# EAGLE design Lora_sensor (EAGLE 9.5.2)
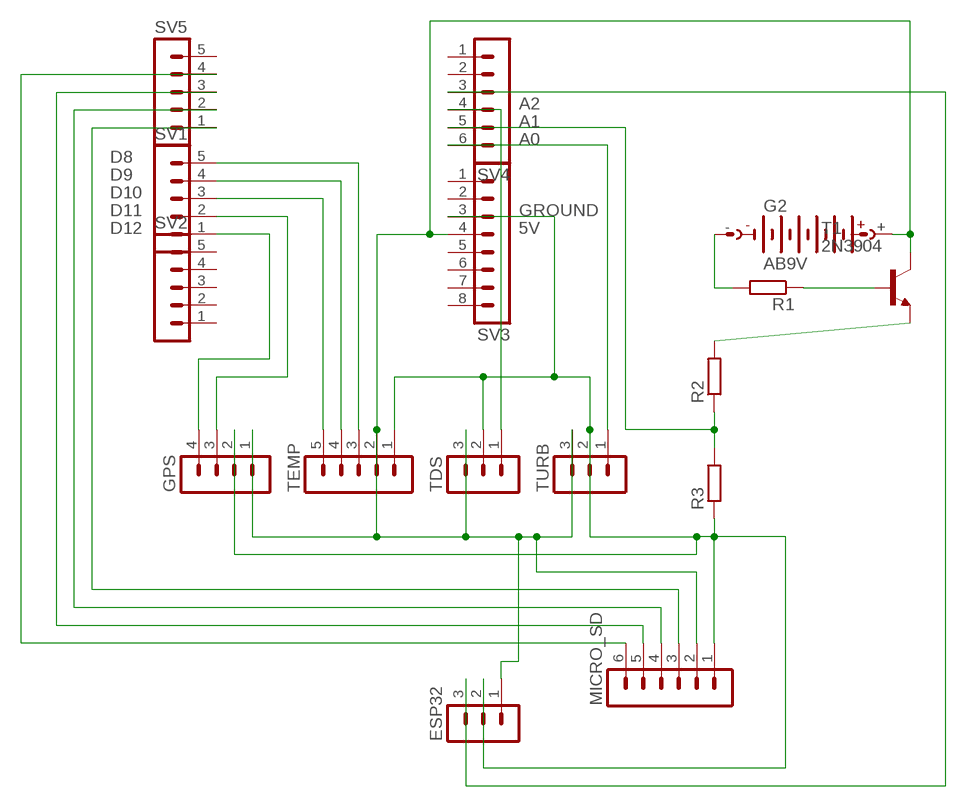
[diagram p0: schematic, sheet 1]

## Parts
ESP32  MA03-1  [MA03-1]
G2  AB9V  [AB9V]
GPS  MA04-1  [MA04-1]
MICRO_SD  MA06-1  [MA06-1]
R1  R-EU_0204/7  [0204/7]
R2  R-EU_0204/7  [0204/7]
R3  R-EU_0204/7  [0204/7]
SV1  MA05-1  [MA05-1]
SV2  MA05-1  [MA05-1]
SV3  MA08-1  [MA08-1]
SV4  MA06-1  [MA06-1]
SV5  MA05-1  [MA05-1]
T1  2N3904  [TO92]
TDS  MA03-1  [MA03-1]
TEMP  MA05-1  [MA05-1]
TURB  MA03-1  [MA03-1]

## Nets
5V: ESP32.1 G2.+ GPS.1 MICRO_SD.2 SV3.4 T1.1(C) TDS.3 TEMP.2 TURB.3
A0: SV4.6 TURB.1
A1: R2.1 R3.2 SV4.5
A2: SV4.4 TDS.1
D8: SV1.5 TEMP.3
D9: SV1.4 TEMP.4
D10: SV1.3 TEMP.5
D11: GPS.3 SV1.2
D12: GPS.4 SV1.1
GROUND: ESP32.2 GPS.2 MICRO_SD.1 R3.1 SV3.3 TDS.2 TEMP.1 TURB.2
N$2: MICRO_SD.3 SV5.1
N$3: MICRO_SD.4 SV5.2
N$4: MICRO_SD.5 SV5.3
N$5: MICRO_SD.6 SV5.4
N$7: ESP32.3 SV4.3
N$9: R2.2 T1.3(E)
N$13: G2.- R1.2
N$14: R1.1 T1.2(B)
Unconnected: SV2.1 SV2.2 SV2.3 SV2.4 SV2.5 SV3.1 SV3.2 SV3.5 SV3.6 SV3.7 SV3.8 SV4.1 SV4.2 SV5.5

## Library data of the parts
ESP32 TDS TURB = con-lstb:MA03-1: PIN HEADER; OC_FARNELL: unknown; OC_NEWARK: unknown
G2 = battery:AB9V: 9-V BATTERY CLIP
GPS = con-lstb:MA04-1: PIN HEADER; OC_FARNELL: unknown; OC_NEWARK: unknown
MICRO_SD SV4 = con-lstb:MA06-1: PIN HEADER; OC_FARNELL: unknown; OC_NEWARK: unknown
R1-R3 = rcl:R-EU_: RESISTOR, European symbol; SPICEPREFIX: R
SV1 SV2 SV5 TEMP = con-lstb:MA05-1: PIN HEADER; OC_FARNELL: unknown; OC_NEWARK: unknown
SV3 = con-lstb:MA08-1: PIN HEADER; OC_FARNELL: unknown; OC_NEWARK: unknown
T1 = transistor:2N3904: NPN TRANSISTOR

## Board
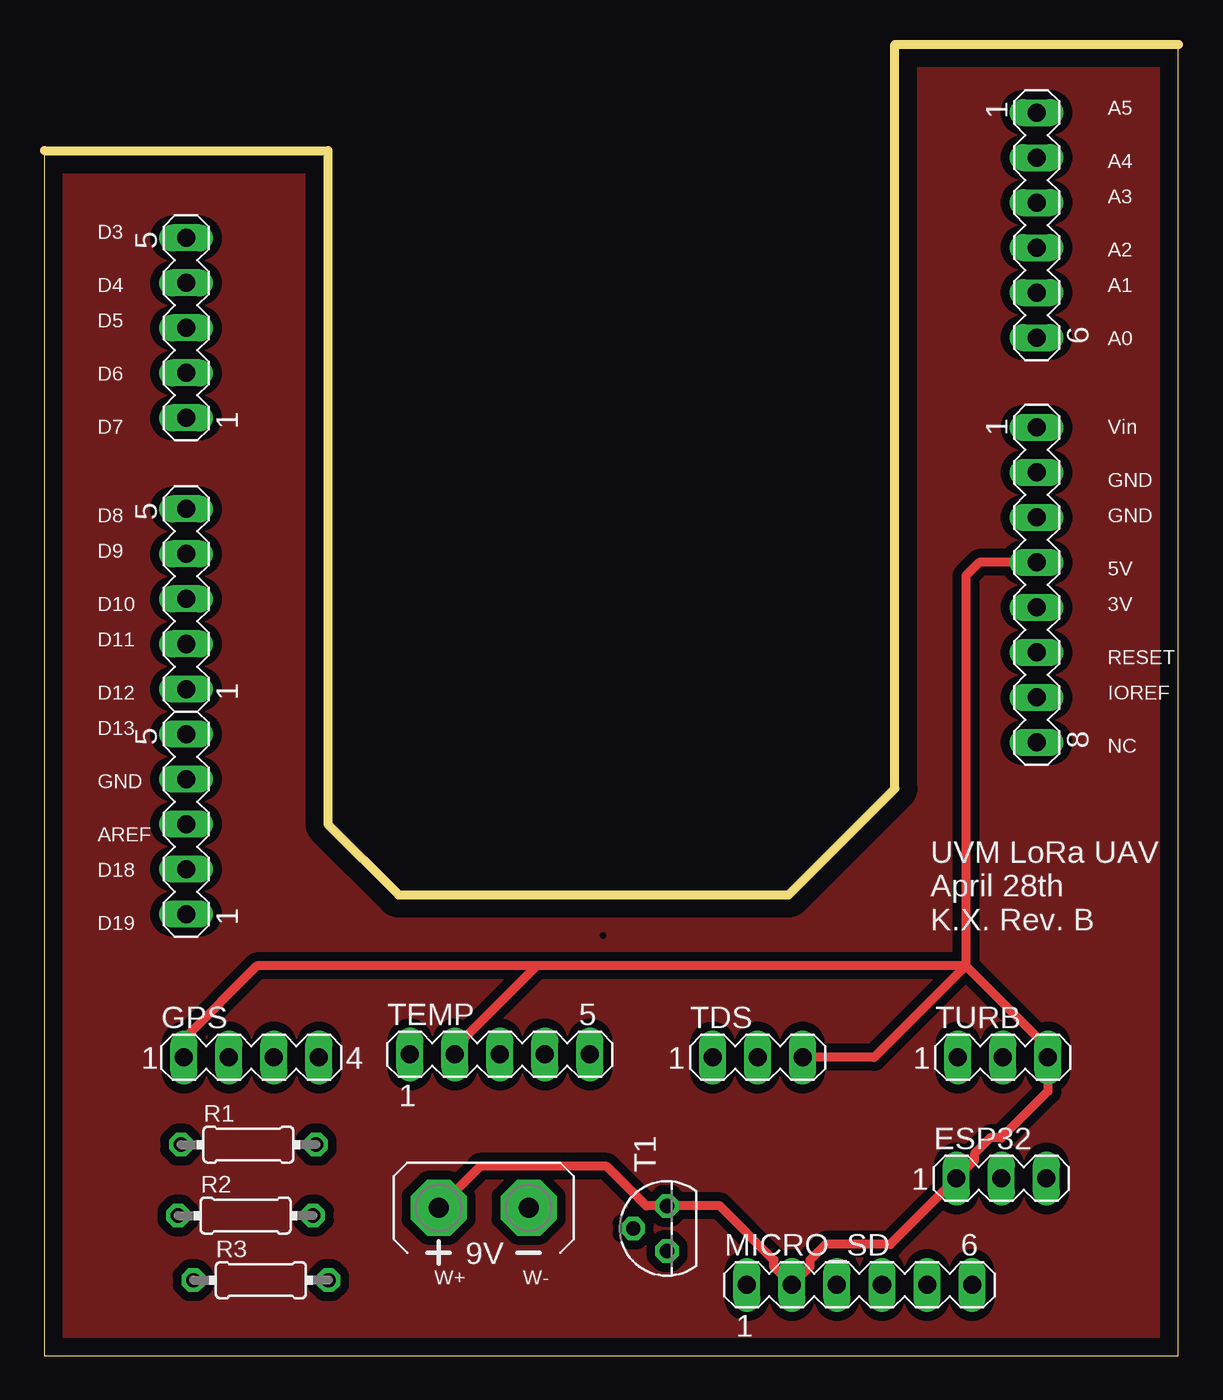
[diagram p1: board, top side]
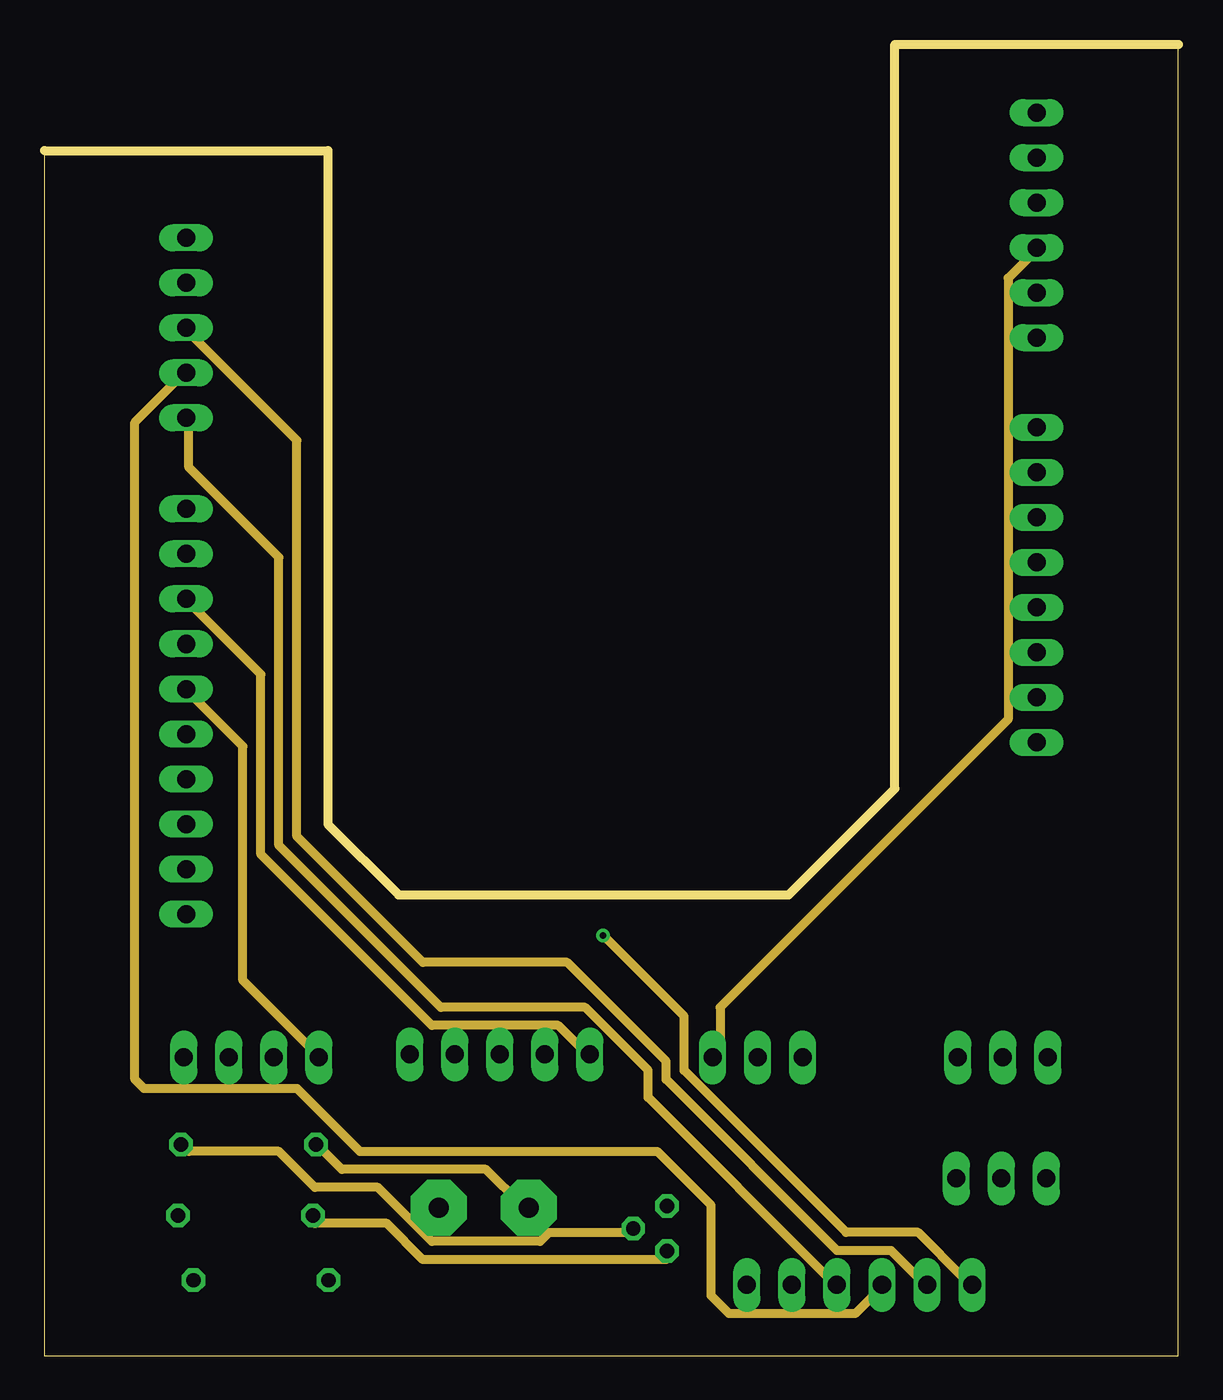
[diagram p2: board, inner layer Route2]
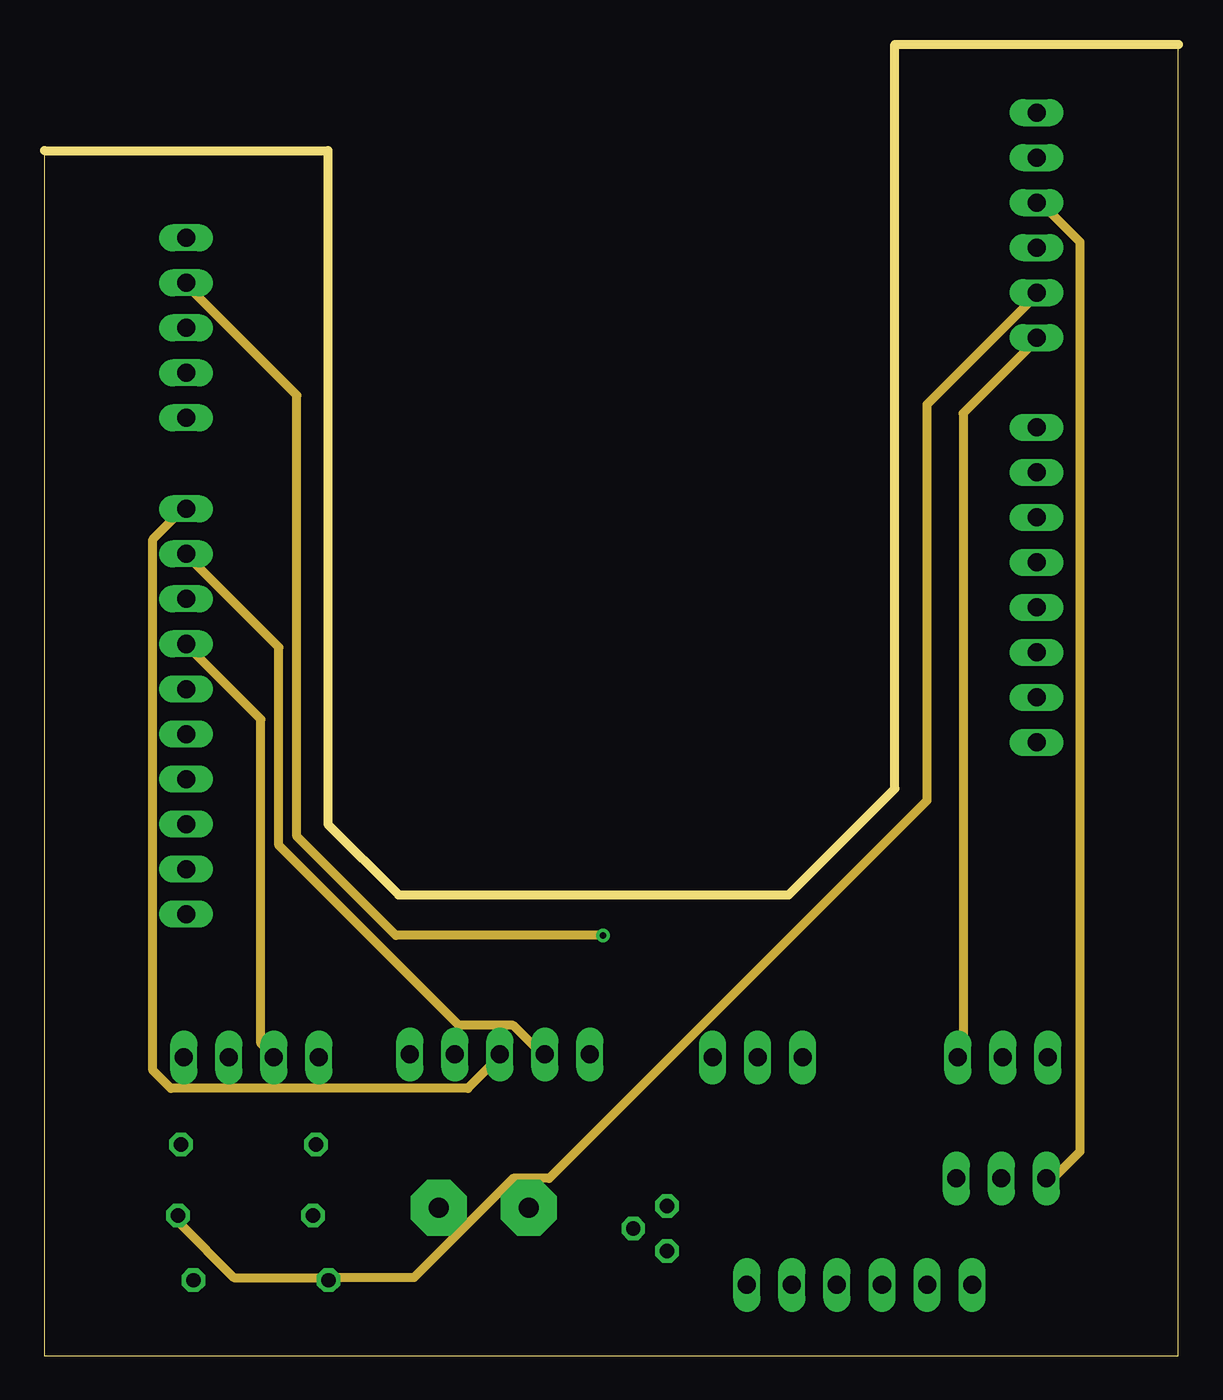
[diagram p3: board, inner layer Route15]
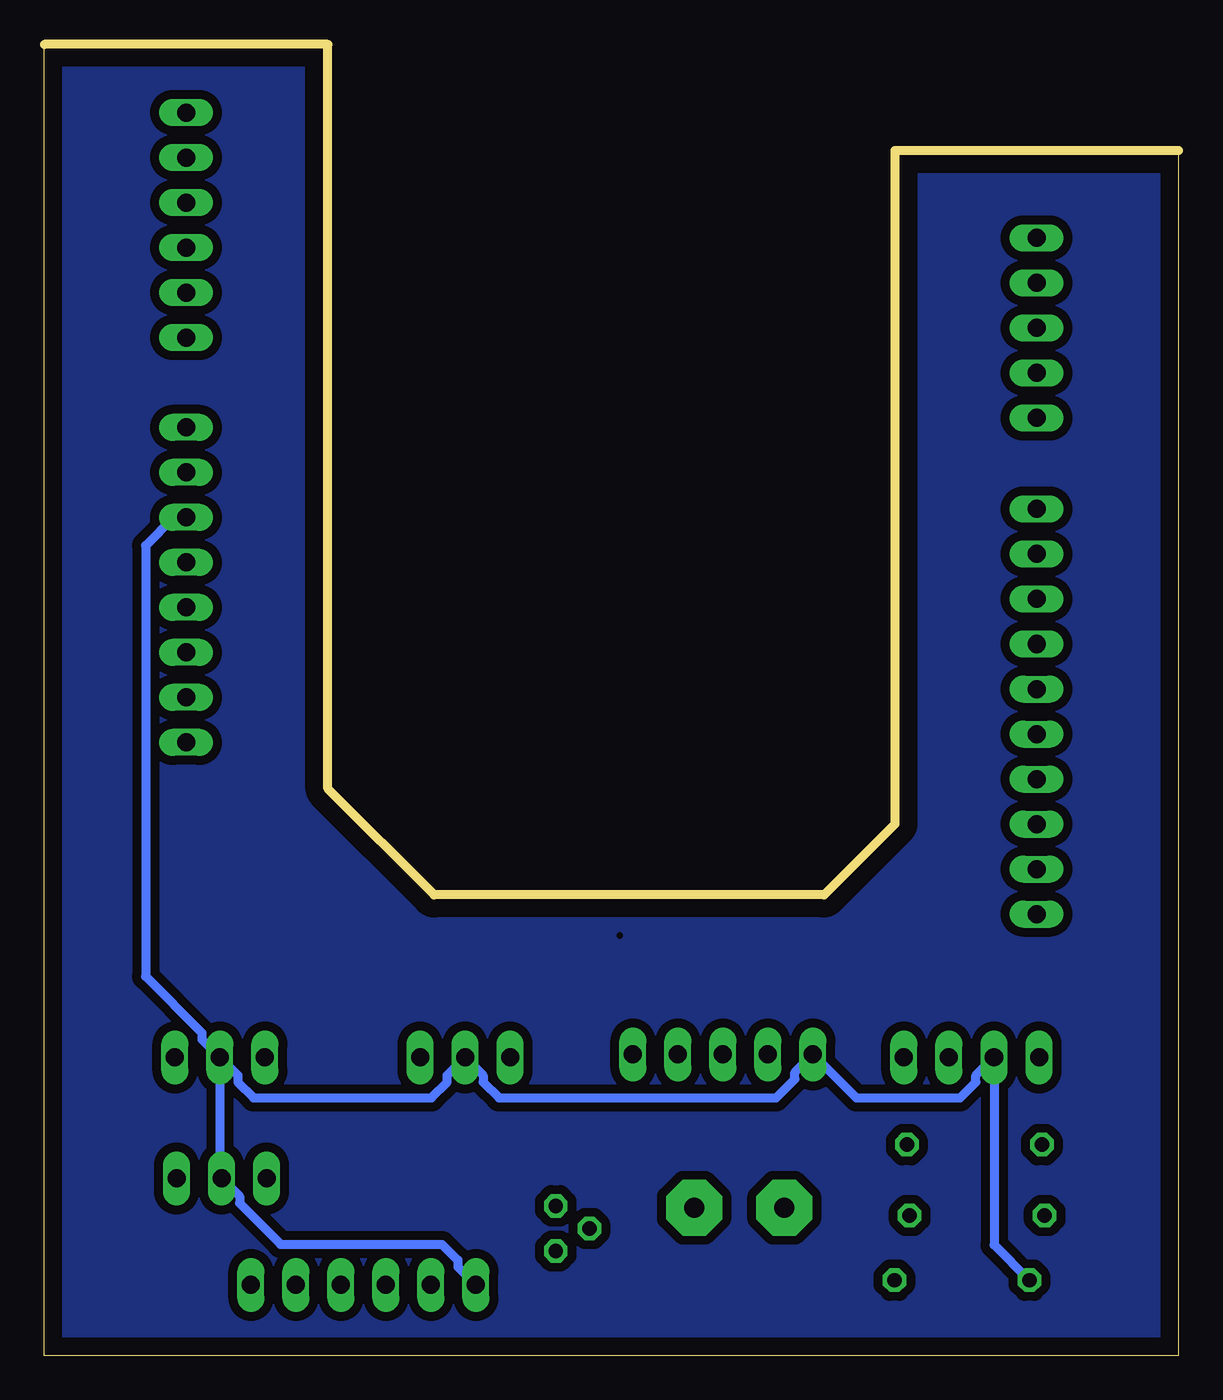
[diagram p4: board, bottom side, seen from below]

Size 64 x 74 mm. Coordinates in mm from the lower left corner, seen from the top.
Outline: 0,0 64,0 64,74 48,74 48,32 42,26 20,26 16,30 16,68 0,68 0,0
Copper layers (1+(2*15)+16): Top 0.035mm / dielectric 1.5mm / Route2 0.035mm / dielectric 0.15mm / Route15 0.035mm / dielectric 0.2mm / Bottom 0.035mm
Design rules "default *": minimum track width 20mil, minimum drill 0.35mm, track to track 20mil, track to pad 20mil, pad to pad 20mil, via to via 20mil, smd to smd 6mil, copper to edge 40mil, drill to drill 6mil, minimum pad ring 10mil, minimum via ring 8mil, stop-mask expansion 4mil, vias tented up to drill 0mil, thermal gap 10mil

### Footprints (pad centres in the part's own frame; a part is rotated, then mirrored left to right if it is on the bottom)
MA03-1 = drill 1.016 long: 1 -2.54,0; 2 0,0; 3 2.54,0
AB9V = drill 1.118 pad 3.15 octagon: + 0,2.54; - 0,-2.54
MA04-1 = drill 1.016 long: 1 -3.81,0; 2 -1.27,0; 3 1.27,0; 4 3.81,0
MA06-1 = drill 1.016 long: 1 -6.35,0; 2 -3.81,0; 3 -1.27,0; 4 1.27,0; 5 3.81,0; 6 6.35,0
0204/7 = drill 0.813 octagon: 1 -3.81,0; 2 3.81,0
MA05-1 = drill 1.016 long: 1 -5.08,0; 2 -2.54,0; 3 0,0; 4 2.54,0; 5 5.08,0
MA08-1 = drill 1.016 long: 1 -8.89,0; 2 -6.35,0; 3 -3.81,0; 4 -1.27,0; 5 1.27,0; 6 3.81,0; 7 6.35,0; 8 8.89,0
TO92 = drill 0.813 octagon: 1 1.27,0; 2 0,1.905; 3 -1.27,0

### Placement (x,y rotation side)
ESP32  54,10 0 top
G2  24.79,8.35 90 top
GPS  11.68,16.83 0 top
MICRO_SD  46,4 0 top
R1  11.52,11.91 0 top
R2  11.36,7.91 0 top
R3  12.22,4.26 0 top
SV1  8,42.7 90 top
SV2  8,30 90 top
SV3  56,43.5 270 top
SV4  56,63.8 270 top
SV5  8,58 90 top
T1  35.14,7.18 90 top
TDS  40.25,16.83 0 top
TEMP  25.71,17 0 top
TURB  54.09,16.83 0 top

### Tracks (layer width: path | path; a pad name or v marks a point on that pad's centre or on a via)
5V
  Top 0.508: SV3.4 52.77,44.77 52,44 52,22 | 52,22 56.63,17.37 TURB.3 56.63,14.92 54,12.29 53.37,12.29 52.48,11.39 52.48,11.02 ESP32.1 47.75,6.29 44.1,6.29 43.21,5.39 43.21,5.02 MICRO_SD.2 41.17,5.02 41.17,5.39 38.12,8.45 T1.1 33.98,8.45 31.74,10.69 24.59,10.69 G2.+ | 52,22 46.83,16.83 TDS.3 | 27.79,22 23.17,17.38 TEMP.2 | 52,22 27.79,22 | 27.79,22 12,22 7.87,17.87 GPS.1
A0
  Route15 0.508: TURB.1 51.85,17.11 51.85,53.18 55.91,57.24 SV4.6
A1
  Route15 0.508: SV4.5 55.91,59.78 49.82,53.69 49.82,31.34 28.48,10 26.45,10 20.86,4.41 16.29,4.41 R3.2 15.78,4.41 10.7,4.41 7.65,7.46 R2.1
A2
  Route2 0.508: TDS.1 38.13,17.11 38.13,19.65 54.39,35.91 54.39,60.8 55.91,62.32 SV4.4
D8
  Route15 0.508: SV1.5 7.65,47.59 6.13,46.07 6.13,16.1 7.14,15.08 23.91,15.08 25.43,16.6 TEMP.3
D9
  Route15 0.508: SV1.4 8.16,45.05 13.24,39.97 13.24,28.8 23.4,18.64 26.45,18.64 27.97,17.11 TEMP.4
D10
  Route2 0.508: SV1.3 8.16,42.51 12.22,38.45 12.22,28.29 21.88,18.64 28.99,18.64 30.51,17.11 TEMP.5
D11
  Route15 0.508: SV1.2 8.16,39.97 12.22,35.91 12.22,17.62 12.73,17.11 GPS.3
D12
  Route2 0.508: SV1.1 8.16,37.43 11.21,34.38 11.21,21.18 15.27,17.11 GPS.4
GND
  pour Bottom (isolate 0.305): 0,68 16,68 16,30 20,26 42,26 48,32 48,74 64,74 64,0 0,0
GROUND
  Bottom 0.508: SV3.3 56.69,47.31 58.29,45.71 58.29,21.4 55.11,18.22 55.11,17.85 TURB.2 | TURB.2 54.09,10.09 ESP32.2 52.98,8.98 52.98,8.61 50.66,6.29 41.56,6.29 40.67,5.39 40.67,5.02 MICRO_SD.1 | TURB.2 53.07,15.81 53.07,15.44 52.18,14.54 42.16,14.54 41.27,15.44 41.27,15.81 TDS.2 39.23,15.81 39.23,15.44 38.34,14.54 22.71,14.54 21.65,15.61 21.65,15.98 TEMP.1 18.17,14.54 12.32,14.54 11.43,15.44 11.43,15.81 GPS.2 10.41,6.26 R3.1
N$2
  Route2 0.508: SV5.1 8.16,52.67 8.16,50.13 13.24,45.05 13.24,28.8 22.38,19.65 30.51,19.65 34.07,16.1 34.07,14.57 44.23,4.41 MICRO_SD.3
N$3
  Route2 0.508: SV5.2 7.65,55.21 5.11,52.67 5.11,15.59 5.62,15.08 14.26,15.08 17.81,11.52 34.58,11.52 37.62,8.48 37.62,3.4 38.64,2.38 45.75,2.38 47.28,3.9 MICRO_SD.4
N$4
  Route2 0.508: SV5.3 8.16,57.75 14.26,51.66 14.26,29.3 21.37,22.19 29.5,22.19 35.08,16.6 35.08,15.59 44.74,5.94 47.78,5.94 49.31,4.41 MICRO_SD.5
N$5  (via drill 0.35 layers 2-15)
  Route2 0.508: v31.53,23.72 36.1,19.14 36.1,16.1 45.24,6.95 49.31,6.95 51.85,4.41 MICRO_SD.6
  Route15 0.508: v31.53,23.72 19.84,23.72 14.26,29.3 14.26,54.2 8.16,60.29 SV5.4
N$7
  Route15 0.508: SV4.3 56.42,64.86 58.45,62.83 58.45,11.52 56.93,10 ESP32.3
N$9
  Route2 0.508: R2.2 15.27,7.46 19.34,7.46 21.37,5.43 35.08,5.43 T1.3
N$13
  Route2 0.508: R1.2 15.78,11.52 16.8,10.51 24.92,10.51 26.96,8.48 G2.-
N$14
  Route2 0.508: T1.2 33.05,6.95 28.48,6.95 27.97,6.44 21.88,6.44 18.83,9.49 15.27,9.49 13.24,11.52 8.16,11.52 R1.1
POWER
  pour Top (isolate 0.305): 0,68 0,0 64,0 64,74 48,74 48,32 42,26 20,26 16,30 16,68

### Text on the board
tNames: A5 | A4 | A3 | D3 | A2 | D4 | A1 | D5 | A0 | D6 | D7 | Vin | GND | D8 | GND | D9 | 5V | D10 | 3V | D11 | RESET | D12 | IOREF | D13 | NC | GND | AREF | D18 | D19 | UVM LoRa UAV / April 28th / K.X. Rev. B | W+ | W-